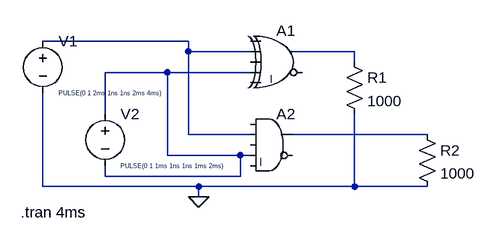
[diagram p0: schematic HALF ADDER.asc]
HALF ADDER.asc, the LTspice schematic file:
Version 4
SHEET 1 880 680
WIRE 160 96 -64 96
WIRE 160 112 160 96
WIRE 256 112 160 112
WIRE 416 112 320 112
WIRE 416 128 416 112
WIRE 128 144 32 144
WIRE 256 144 128 144
WIRE 32 208 32 144
WIRE 160 240 160 112
WIRE 256 240 160 240
WIRE 528 240 320 240
WIRE 128 272 128 144
WIRE 240 272 128 272
WIRE 256 272 240 272
WIRE 32 304 32 288
WIRE 240 304 240 272
WIRE 240 304 32 304
WIRE -64 320 -64 176
WIRE 176 320 -64 320
WIRE 416 320 416 208
WIRE 416 320 176 320
WIRE 528 320 416 320
WIRE 176 336 176 320
FLAG 176 336 0
SYMBOL Digital\\xor 304 64 R0
SYMATTR InstName A1
SYMBOL Digital\\and 288 192 R0
SYMATTR InstName A2
SYMBOL res 400 112 R0
SYMATTR InstName R1
SYMATTR Value 1000
SYMBOL res 512 224 R0
SYMATTR InstName R2
SYMATTR Value 1000
SYMBOL voltage -64 80 R0
WINDOW 3 24 96 Left 0
WINDOW 123 0 0 Left 0
WINDOW 39 0 0 Left 0
SYMATTR InstName V1
SYMATTR Value PULSE(0 1 2ms 1ns 1ns 2ms 4ms)
SYMBOL voltage 32 192 R0
WINDOW 3 24 96 Left 0
WINDOW 123 0 0 Left 0
WINDOW 39 0 0 Left 0
SYMATTR InstName V2
SYMATTR Value PULSE(0 1 1ms 1ns 1ns 1ms 2ms)
TEXT -98 360 Left 2 !.tran 4ms

The netlist it stands for:
* HALF ADDER.asc
A1 0 N001 0 N003 0 0 N002 0 XOR
A2 0 N001 0 N003 0 0 N004 0 AND
R1 N002 0 1000
R2 N004 0 1000
V1 N001 0 PULSE(0 1 2ms 1ns 1ns 2ms 4ms)
V2 N003 N003 PULSE(0 1 1ms 1ns 1ns 1ms 2ms)
.tran 4ms
.backanno
.end